# EAGLE design ict_v361-xs (EAGLE 9.6.2)
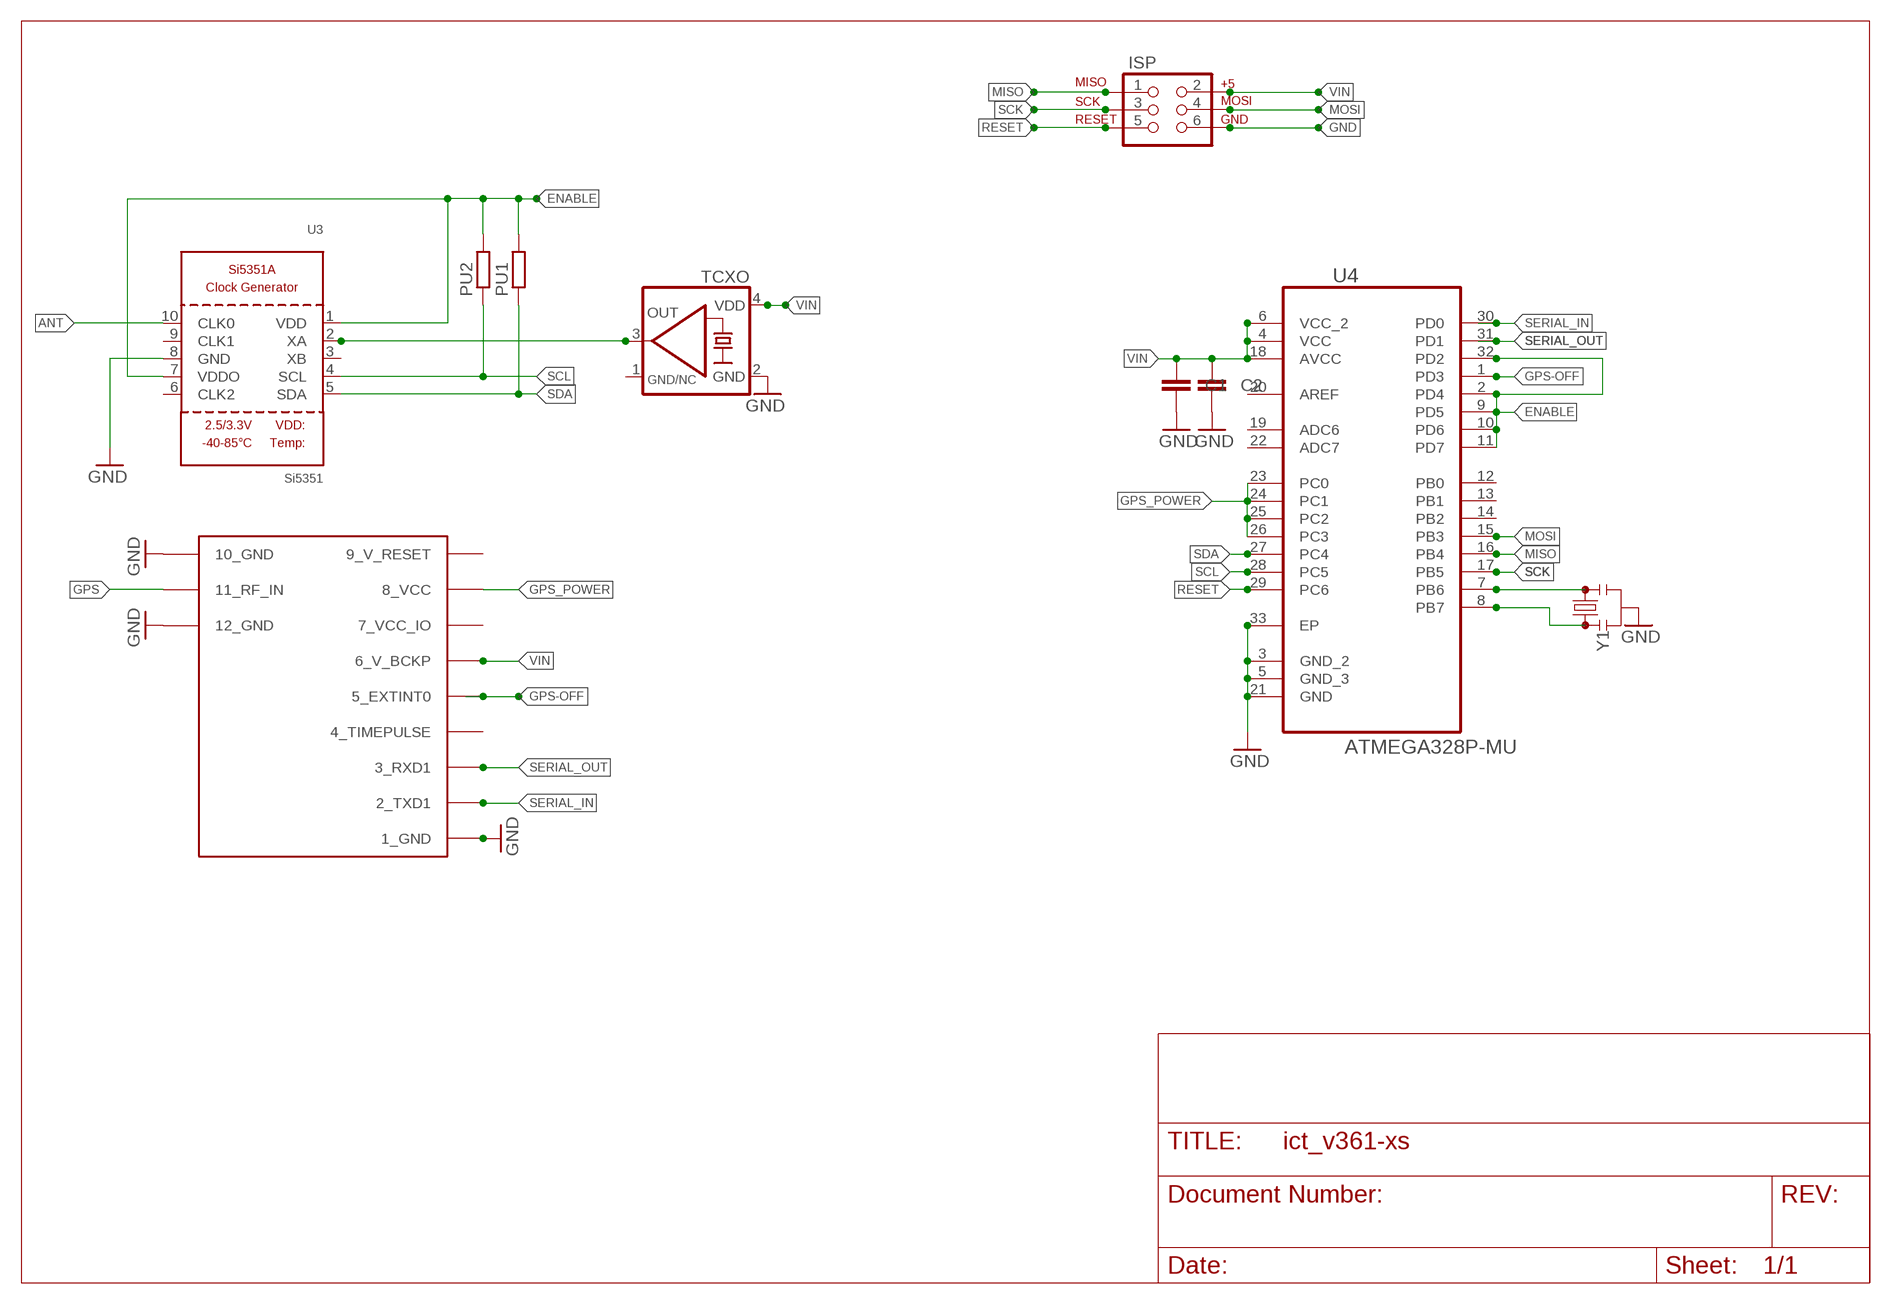
[diagram p0: schematic, sheet 1]

## Parts
C1  C-EUC0603K  [C0603K]
C2  C-EUC0603K  [C0603K]
ISP  AVR_SPI_PRG_6PTH  [2X3]
PU1  R-EU_R0603  [R0603]
PU2  R-EU_R0603  [R0603]
TCXO  KXO-TCXO-CMOS-84  [3.2X2.5_KXO-84-TCXO]
U3  Si5351  SI5351A  [MSOP10]
U4  ATMEGA328P-MU  [QFN50P500X500X100-33N]
U$2  UBLOX_MAX  [UBLOX_MAX]
Y1  RESONATORSMD-4.5X2.0  [RESONATOR-SMD-4.5X2.0]

## Nets
ANT: U3.10(CLK0)
ENABLE: PU1.2 PU2.2 U3.1(VDD) U3.7(VDDO) U4.2(PD4) U4.9(PD5) U4.10(PD6) U4.11(PD7) U4.32(PD2)
GND: C1.2 C2.2 ISP.6 TCXO.2(GND) U3.8(GND) U4.3(GND_2) U4.5(GND_3) U4.21(GND) U4.33(EP) U$2.1_GND U$2.10_GND U$2.12_GND Y1.2
GPS: U$2.11_RF_IN
GPS-OFF: U4.1(PD3) U$2.5_EXTINT0
GPS_POWER: U4.23(PC0) U4.24(PC1) U4.25(PC2) U4.26(PC3) U$2.8_VCC
MISO: ISP.1 U4.16(PB4)
MOSI: ISP.4 U4.15(PB3)
N$1: U4.7(PB6) Y1.3
N$3: U4.8(PB7) Y1.1
N$19: TCXO.3(OUT) U3.2(XA)
RESET: ISP.5 U4.29(PC6)
SCK: ISP.3 U4.17(PB5)
SCL: PU2.1 U3.4(SCL) U4.28(PC5)
SDA: PU1.1 U3.5(SDA) U4.27(PC4)
SERIAL_IN: U4.30(PD0) U$2.2_TXD1
SERIAL_OUT: U4.31(PD1) U$2.3_RXD1
VIN: C1.1 C2.1 ISP.2 TCXO.4(VDD) U4.4(VCC) U4.6(VCC_2) U4.18(AVCC) U$2.6_V_BCKP
Unconnected: U3.3(XB) U3.6(CLK2) U3.9(CLK1) U4.12(PB0) U4.13(PB1) U4.14(PB2) U4.19(ADC6) U4.20(AREF) U4.22(ADC7) U$2.4_TIMEPULSE

## Power pins joined to a net without a drawn wire
7_VCC_IO: U$2.7_VCC_IO
9_V_RESET: U$2.9_V_RESET
GND/NC: TCXO.1(GND/NC)

## Library data of the parts
C1 C2 = rcl:C-EU: CAPACITOR, European symbol; SPICEPREFIX: C
ISP = SparkFun:AVR_SPI_PRG_6: AVR ISP 6 Pin This is the reduced ISP connector for AVR programming. Common on Arduino. This footprint will take up less PCB space and can be used with a 10-pin to 6-pin adapter such as SKU: BOB-08508
PU1 PU2 = resistor:R-EU_: RESISTOR, European symbol
TCXO = crystal-geyer_V1_0:KXO-TCXO-CMOS: TCXO : CMOS - Serie Model Size l/w/h [mm] Frequency Range Frequency Stability Temp. Range [°C] Output AECQ 200 availabel Datasheet KXO-86 KXO-84 KXO-83 KXO-82 2.5/2.0/0.7 3.2/2.5/1.0 5.0/3.2/1.5 7.0/5.0/2.4 13,0 ~ 40,0 MHz 10,0 ~ 40,0 MHz 10,0 ~ 40,0 MHz 10,0 ~ 30,0 MHz ±1,0 … ±2,5ppm ±1,0 … ±2,5ppm ±1,0 … ±3,0ppm ±1,0 … ±3,0ppm (*) -30°C …+75°C (*) -40°C …+85°C (*) -40°C …+85°C (*) -30°C …+80°C CMOS CMOS CMOS CMOS - - - - KXO-86.pdf <http://www.geyer-electronic.de/uploads/tx_userartikelfrequenz/GEYER-KXO-86-TCXO-HCMOS.pdf> KXO-84.pdf <http://www.geyer-electronic.de/uploads/tx_userartikelfrequenz/GEYER-KXO-84-TCXO-HCMOS.pdf> KXO-83.pdf <http://www.geyer-electronic.de/uploads/tx_userartikelfrequenz/GEYER-KXO-83-TCXO-HCMOS.pdf> KXO-82.pdf <http://www.geyer-electronic.de/uploads/tx_userartikelfrequenz/GEYER-KXO-82-TCXO-HCMOS.pdf> <http://www.geyer-electronic.de/fileadmin/template/img/logo-geyer-electronic.png> Details see: http://www.geyer-electronic.de/Frequenz-Produkte.9.0.html Created 2016-06-07, Hans Locher 2016 (C) Geyer Quartz Technology KXO86,KXO84,KXO83,KXO82;2550;3225;5032;7050;2,5x2,0;3,2x2,5;2.5x2.0;3.2x2.5,5,0x3,2;7,0x5,0,5.0x3.2,7.0x5.0
U3 = microbuilder:SI5351A: Si5351A 8kHz-160MHz I2C Clock Generator VDD: 2.5V or 3.3V Input Range: 25MHz or 27MHz XTAL User selectable internal input load capacitors: 6, 8 or 10 pF Output Impedance: 85 Ohm Output Load Capacitance: 5-15pF Operating Temperature: -40°C - 85°C Operating Current (3 outputs): 35mA Output buffer voltage (VDDO): 1.8, 2.5 or 3.3V Note: If VDDO is not used it should be connected to VDD. Unused clock out pins should be left floating.
U4 = ava:ATMEGA328P-MU: Programmable Flash; MPN: ATMEGA328P-MU; OC_FARNELL: 1748522; OC_NEWARK: 26R2526; PACKAGE: QFN-32; SUPPLIER: Atmel
U$2 = Max gps:UBLOX_MAX: UBLOX MAX
Y1 = SparkFun-Clocks:RESONATOR: Resonators (Generic) Ceramic resonators are clock-generating components, often used to control timing in microcontrollers. They usually have 3 pins: two pins for oscillation, and one pin for ground. Compared to crystals, resonators have worse tolerance, but are usually much cheaper. Plus, they have built-in load capacitors! These devices are used on boards like the Arduino Pro 8MHz <https://www.sparkfun.com/products/11114> and Arduino Pro 16MHz <https://www.sparkfun.com/products/11113>.

## Net classes
0 default: width 0.203 mm
1 vcc: width 0.152 mm, clearance 0.152 mm

## Board
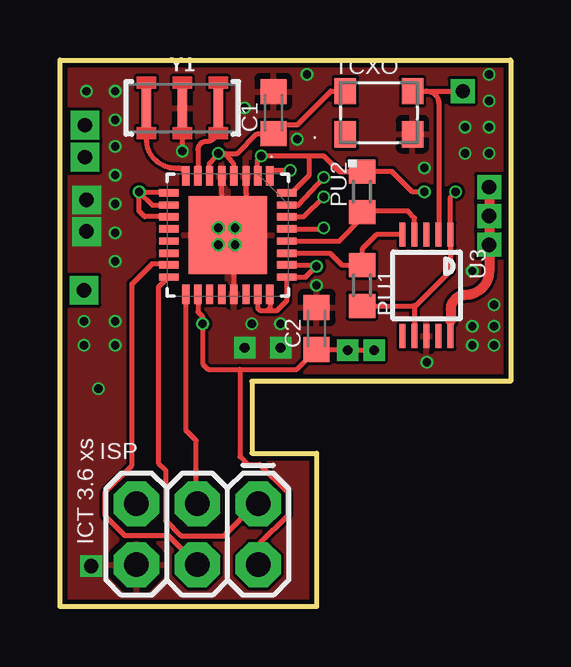
[diagram p1: board, top side]
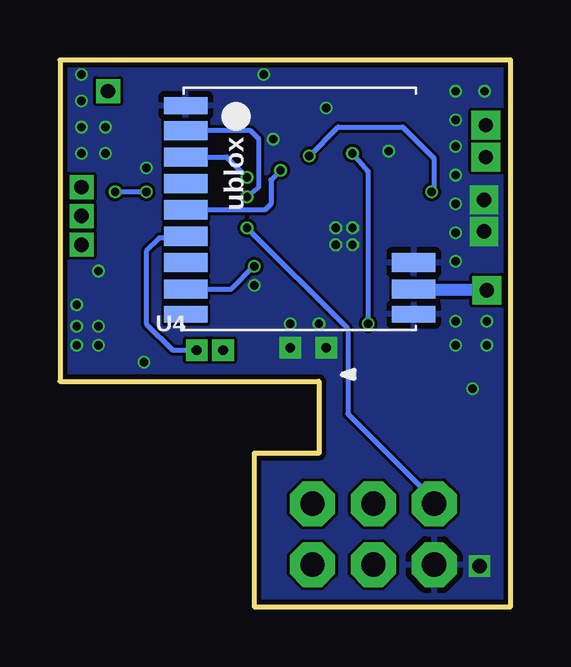
[diagram p2: board, bottom side, seen from below]

Size 18.8 x 22.8 mm. Coordinates in mm from the lower left corner, seen from the top.
Outline: 0,22.8 18.8,22.8 18.8,9.4 8,9.4 8,6.4 10.7,6.4 10.7,0 0,0 0,22.8
Copper layers (1*16): Top 0.035559375mm / dielectric 1.6mm / Bottom 0.035559375mm
Design rules "jlcpcb2layer *": minimum track width 5mil, minimum drill 12mil, track to track 5mil, track to pad 5mil, pad to pad 5mil, via to via 5mil, smd to smd 5mil, copper to edge 8mil, drill to drill 6mil, minimum pad ring 5mil, minimum via ring 3mil, stop-mask expansion 2.5mil, vias tented up to drill 14mil, thermal gap 10mil

### Footprints (pad centres in the part's own frame; a part is rotated, then mirrored left to right if it is on the bottom)
C0603K = smd 1.05 x 1.08: 1 -0.875,0; 2 0.875,0
2X3 = drill 1.016 pad 1.88 octagon: 1 0,0; 2 0,2.54; 3 2.54,0; 4 2.54,2.54; 5 5.08,0; 6 5.08,2.54
R0603 = smd 1 x 1.1: 1 -0.85,0; 2 0.85,0
3.2X2.5_KXO-84-TCXO = smd 0.9 x 1.1: 1 -1.4,-0.9; 2 1.4,-0.9; 3 1.4,0.9; 4 -1.4,0.9
MSOP10 = smd 0.25 x 1: 1 -1,-2.113; 2 -0.5,-2.113; 3 0,-2.113; 4 0.5,-2.113; 5 1,-2.113; 6 1,2.113; 7 0.5,2.113; 8 0,2.113; 9 -0.5,2.113; 10 -1,2.113
QFN50P500X500X100-33N = smd 0.813 x 0.305: 1 -2.464,1.753; 2 -2.464,1.245; 3 -2.464,0.762; 4 -2.464,0.254; 5 -2.464,-0.254; 6 -2.464,-0.762; 7 -2.464,-1.245; 8 -2.464,-1.753; 17 2.464,-1.753; 18 2.464,-1.245; 19 2.464,-0.762; 20 2.464,-0.254; 21 2.464,0.254; 22 2.464,0.762; 23 2.464,1.245; 24 2.464,1.753 | smd 0.305 x 0.813: 9 -1.753,-2.464; 10 -1.245,-2.464; 11 -0.762,-2.464; 12 -0.254,-2.464; 13 0.254,-2.464; 14 0.762,-2.464; 15 1.245,-2.464; 16 1.753,-2.464; 25 1.753,2.464; 26 1.245,2.464; 27 0.762,2.464; 28 0.254,2.464; 29 -0.254,2.464; 30 -0.762,2.464; 31 -1.245,2.464; 32 -1.753,2.464 | smd 3.251 x 3.251: 33 0,0
UBLOX_MAX = smd 1.8 x 0.7: 1_GND 4.95,-4.4; 9_V_RESET 4.95,4.3; 10_GND -4.55,4.3 | smd 1.8 x 0.8: 2_TXD1 4.95,-3.35; 3_RXD1 4.95,-2.25; 4_TIMEPULSE 4.95,-1.15; 5_EXTINT0 4.95,-0.05; 6_V_BCKP 4.95,1.05; 7_VCC_IO 4.95,2.15; 8_VCC 4.95,3.25; 11_RF_IN -4.55,3.25; 12_GND -4.55,2.15
RESONATOR-SMD-4.5X2.0 = smd 0.4 x 1.6: 1 -1.5,0; 2 0,0; 3 1.5,0

### Placement (x,y rotation side)
C1  8.9,20.6 90 top
C2  10.7,11.6 90 top
ISP  8.27,4.29 180 top
PU1  12.6,13.4 270 top
PU2  12.6,17.3 90 top
TCXO  13.3,20.6 0 top
U3  15.29,13.4 180 top
U4  7,15.5 270 top
U$2  8.6,16.5 180 bottom
Y1  5.1,20.8 0 top

### Tracks (layer width: path | path; a pad name or v marks a point on that pad's centre or on a via)
ANT  (via drill 0.6 pad 1)
  Top 0.203: 16.3,11.9 16.29,11.89 U3.10
  Top 0.406: 16.3,11.9 16.3,12.4 arc-90 16.9,13 arc90 17.9,14 v17.9,15.1 v17.9,16.3 v17.9,17.5
ENABLE  (via drill 0.35)
  Top 0.203: 14.79,12.49 U3.7 14.8,11.03 | 14.79,12.49 16.29,13.99 U3.1 16.29,17.09 v16.5,17.3 | PU1.2 14.73,12.55 14.79,12.49 | 10.4,18.8 11,18.8 11.65,18.15 PU2.2 13.85,18.15 14.7,17.3 v15.2,17.3 | 10.4,18.8 v8.4,18.8 8.25,18.64 U4.2 | U4.32 9.65,17.25 10.4,18 10.4,18.8 | v3.3,17.3 4.49,17.3 U4.9 | v3.3,17.3 3.86,16.75 U4.10 | v3.3,17.3 3.3,16.5 3.54,16.26 U4.11
  Bottom 0.203: v15.2,17.3 v16.5,17.3 | v8.4,18.8 7.2,20 4.5,20 3.2,18.7 3.2,17.4 v3.3,17.3
GND  (via drill 0.35, 0.4 pad 0.9, 0.6 pad 0.7, 0.6 pad 1.2)
  Top 0.203: 7.8,17.93 U4.3 7.76,16.26 U4.33 | 5.1,20.3 v5.1,19 | U4.21 7.25,15.25 U4.33 | U4.5 6.75,15.75 U4.33
  other vias: 2.3,19.2 15.3,10.2 18.1,10.9 1.11,16.97 1.11,15.65 1.1,21.5 10.7,13.4 2.3,10.9 2.3,14.4 2.3,15.6 7.7,10.8 2.3,11.9 2.3,16.8 2.3,18 9.2,10.8 2.3,20.3 2.3,21.5 1.6,9.1 1,11.9 1,10.9 8,11.8 9.2,11.8 7.3,15.8 6.6,15.8 6.6,15.1 7.3,15.1 17.9,18.9 17.9,20 17.9,21.1 16.9,20 16.9,18.9 10.3,22.2 17.9,22.2 18.1,12.6 18.1,11.7 17.2,10.9 7.7,20.8 1.3,1.7 15.2,18.3 9.9,19.5 17.2,14 17.2,11.7
  pour Top: -5.29,25.42 37.55,25.42 37.55,-3.69 -5.39,-3.69 -5.39,25.32
  pour Bottom: -5.39,25.42 37.55,25.42 37.55,-3.69 -5.39,-3.69
GPS  (via drill 0.6 pad 1.2)
  Bottom 0.203: 4,13.2 U$2.11_RF_IN
  Bottom 0.508: v1,13.2 4,13.2
GPS-OFF  (via drill 0.35)
  Top 0.203: U4.1 8.75,18.06 8.89,18.2 v9.6,18.2
  Bottom 0.203: v9.6,18.2 10,17.8 10,16.8 10.25,16.55 U$2.5_EXTINT0
GPS_POWER  (via drill 0.35)
  Top 0.203: 8.79,13 U4.24 8.75,12.45 8.65,12.35 | 9.56,14.25 U4.26 10.64,14.25 v10.7,14.2 10.25,13.75 U4.25 9.46,12.76 9.05,12.35 8.65,12.35 | U4.23 8.25,12.45 8.35,12.35 8.65,12.35
  Bottom 0.203: U$2.8_VCC 11.65,13.25 v10.7,14.2
MISO
  Top 0.203: ISP.1 8.16,4.29 6.84,2.96 5.04,2.96 4.4,3.6 4.4,5.7 4.1,6 4.1,13.31 U4.16
MOSI
  Top 0.203: U4.15 4.47,14.26 | 4.63,14.29 U4.15 | U4.15 4.5,14.29 3.83,14.29 3,13.46 3,5.9 1.89,4.78 1.89,3.79 2.71,2.96 4.53,2.96 5.68,1.81 ISP.4
N$1
  Top 0.203: Y1.3 6.6,19.9 arc-90 6.1,19.4 arc90 5.76,19.05 U4.7
N$3
  Top 0.203: Y1.1 3.6,19.5 arc90 4.8,18.3 4.91,18.3 arc-90 U4.8
N$7  (via drill 0.6 pad 1.2)
  other vias: 1.04,20.08
N$8  (via drill 0.6 pad 1.2)
  other vias: 1.04,18.75
N$19  (via drill 0.6 pad 1)
  Top 0.203: U3.2 arc90 15.8,15.52 15.8,21 arc90 15.3,21.5 TCXO.3 v16.8,21.5
RESET  (via drill 0.35)
  Top 0.203: U4.29 10.99,15.75 v11,15.8
  Bottom 0.203: v11,15.8 6.8,11.6 6.8,8.04 3.21,4.45 ISP.5
SCK
  Top 0.203: 5.29,13.04 U4.17 5.25,7.36 5.68,6.93 5.68,4.45 ISP.3
SCL
  Top 0.203: U4.28 11.65,15.25 12.6,16.2 PU2.1 12.65,16.5 14.5,16.5 14.79,16.21 U3.4
SDA
  Top 0.203: U3.5 13.2,15.51 12.6,14.91 PU1.1 11.75,14.25 11.26,14.74 U4.27
SERIAL_IN  (via drill 0.35)
  Top 0.203: U4.30 10.16,16.26 v11,17.1
  Bottom 0.203: U$2.2_TXD1 10.85,19.85 10.5,19.5 10.5,17.5 v11,17.1
SERIAL_OUT  (via drill 0.35)
  Top 0.203: U4.31 9.95,16.75 v11,17.9
  Bottom 0.203: v11,17.9 11.85,18.75 U$2.3_RXD1
VIN  (via drill 0.35, 0.4 pad 0.9)
  Top 0.203: U4.18 5.76,12.29 5.95,12.1 v5.95,11.8 5.95,10.13 6.18,9.9 7.5,9.9 | 7.5,9.9 9.88,9.9 C2.1 11.98,10.73 v12,10.7 v13.1,10.7 | U4.6 6.24,18.49 6.51,18.76 v6.6,18.9 | U4.4 7.25,18.45 6.9,18.9 arc-62 v6.6,18.9 | v6.6,18.9 7.4,18.9 8.23,19.72 C1.1 9.27,20.1 9.9,20.1 11.3,21.5 TCXO.4 | 7.5,9.9 7.5,6.27 7.83,5.94 8.33,5.94 9.48,4.78 9.48,3.79 8.33,2.63 8.33,1.81 ISP.2
  Bottom 0.203: v6.6,18.9 5.95,18.15 v5.95,11.8 | U$2.6_V_BCKP 13.62,15.38 14.64,15.38 15.2,14.82 15.2,11.8 14.1,10.7 v13.1,10.7

### Text on the board
tPlace: .
tNames: . | ICT 3.6 xs
bNames: U4